# EAGLE design 89c2051-a5000-ps2 (EAGLE 4.16)
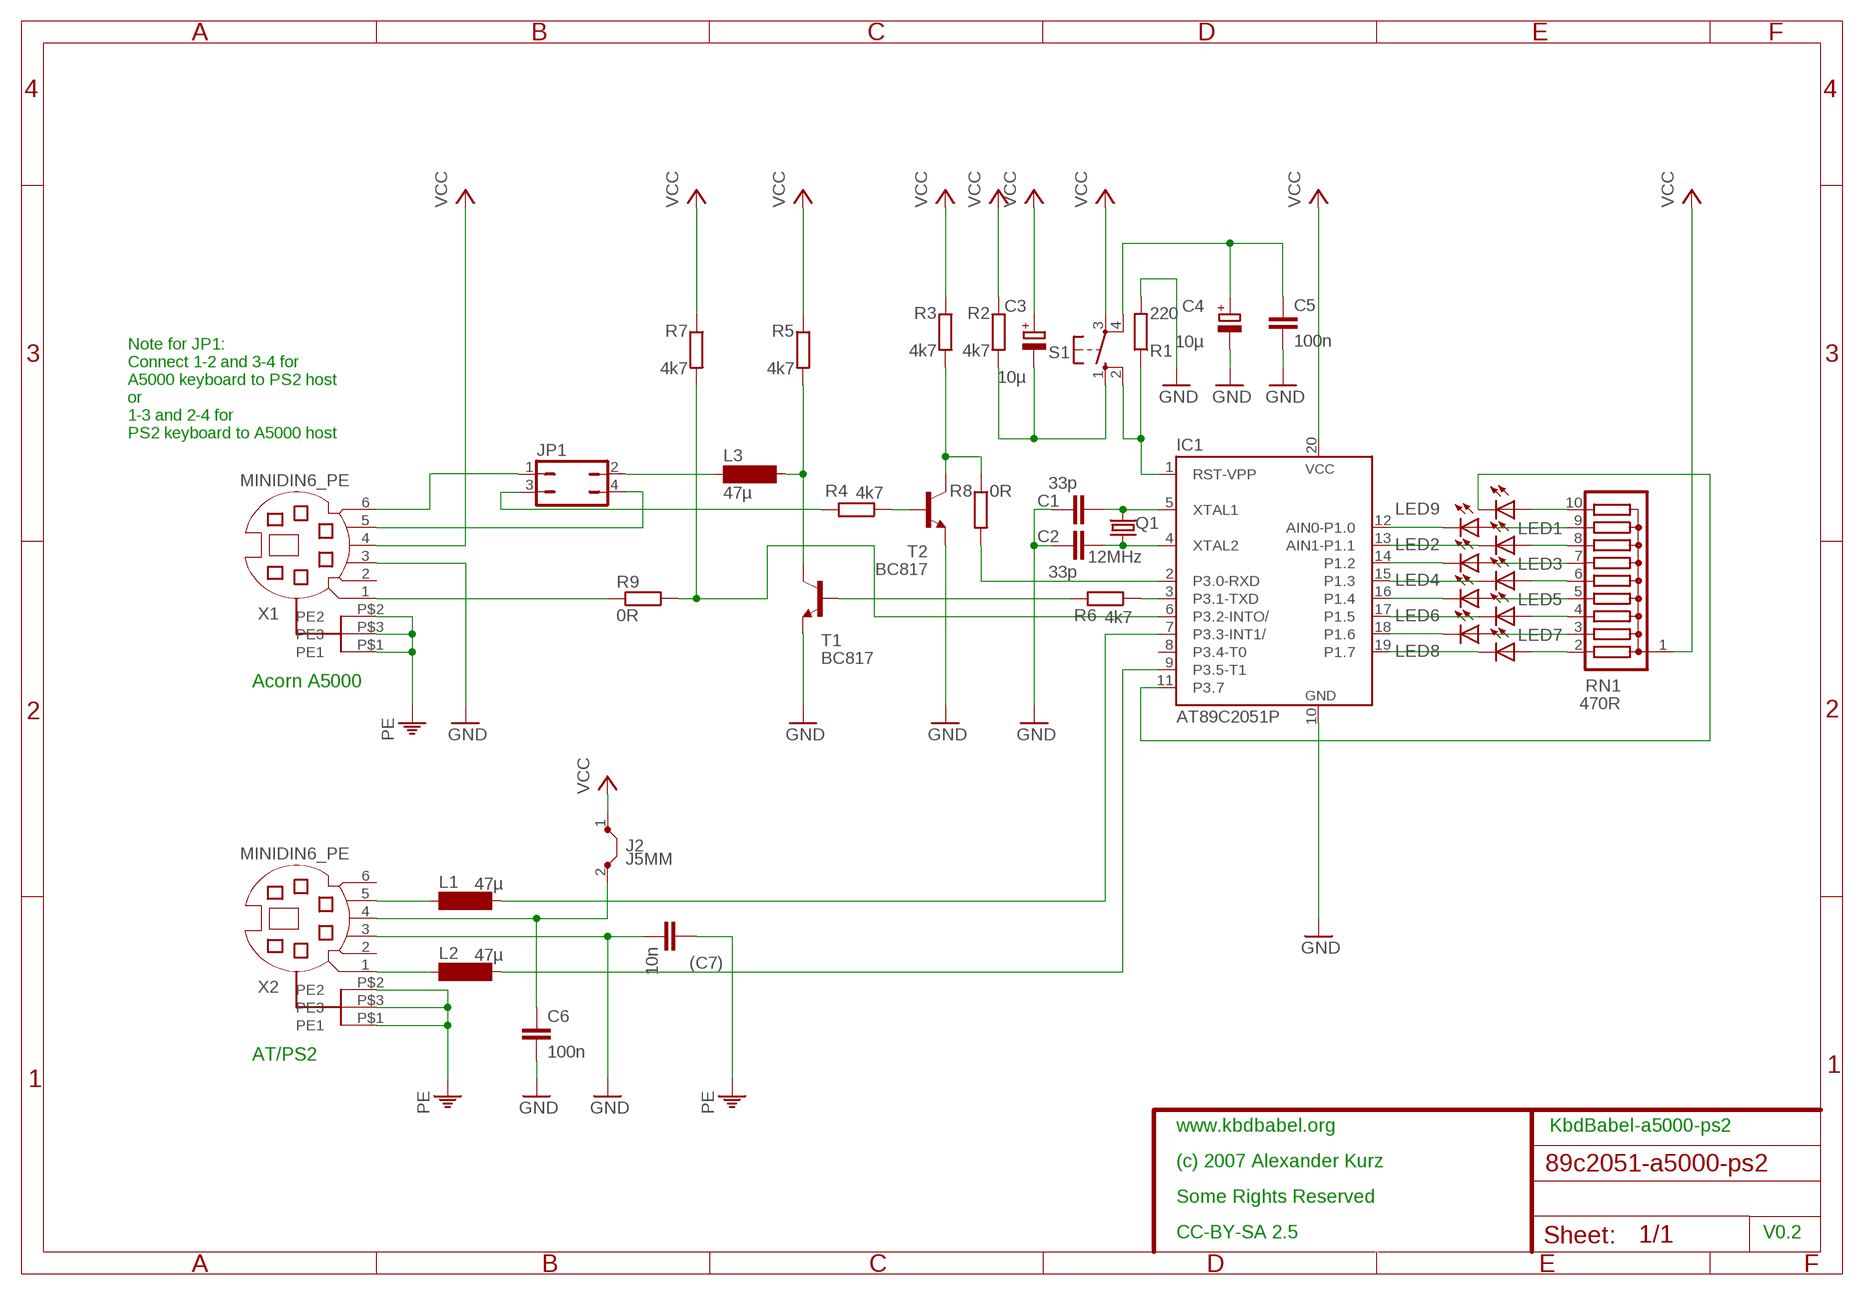
[diagram p0: schematic, sheet 1]

## Parts
(C7)  10n  C-EUC1206  [C1206]
C1  33p  C-EUC0805  [C0805]
C2  33p  C-EUC0805  [C0805]
C3  10µ  CPOL-EUE2-5  [E2-5]
C4  10µ  CPOL-EUE2-5  [E2-5]
C5  100n  C-EUC1206  [C1206]
C6  100n  C-EUC1206  [C1206]
IC1  AT89C2051P  [DIL20]
J2  J5MM  [05]
JP1  JP2Q  [JP2Q]
L1  47µ  SD75  [SD75]
L2  47µ  SD75  [SD75]
L3  47µ  SD75  [SD75]
LED1  LEDSQR2X5  [LED2X5]
LED2  LEDSQR2X5  [LED2X5]
LED3  LEDSQR2X5  [LED2X5]
LED4  LEDSQR2X5  [LED2X5]
LED5  LEDSQR2X5  [LED2X5]
LED6  LEDSQR2X5  [LED2X5]
LED7  LEDSQR2X5  [LED2X5]
LED8  LEDSQR2X5  [LED2X5]
LED9  LEDSQR2X5  [LED2X5]
Q1  12MHz  CRYSTALHC49U70  [HC49U70]
R1  220  R-EU_R1206  [R1206]
R2  4k7  R-EU_R1206  [R1206]
R3  4k7  R-EU_R1206  [R1206]
R4  4k7  R-EU_0204/5  [0204/5]
R5  4k7  R-EU_R1206  [R1206]
R6  4k7  R-EU_R0805  [R0805]
R7  4k7  R-EU_R1206  [R1206]
R8  0R  R-EU_R1206  [R1206]
R9  0R  R-EU_R1206  [R1206]
RN1  470R  G09R  [SIL10]
S1  10-XX  [B3F-10XX]
T1  BC817  BC817-NPN-SOT23-BEC  [SOT23-BEC]
T2  BC817  BC817-NPN-SOT23-BEC  [SOT23-BEC]
X1  MINIDIN6_PE  [MINIDIN6_PE]
X2  MINIDIN6_PE  [MINIDIN6_PE]

## Nets
GND: (C7).2 C1.1 C2.2 C4.- C5.2 C6.2 IC1.10(GND) R1.2 T1.E T2.E X1.3 X2.3
N$1: C1.2 IC1.5(XTAL1) Q1.2
N$2: C2.1 IC1.4(XTAL2) Q1.1
N$3: L1.1 X2.5
N$4: LED1.A RN1.9
N$5: IC1.17(P1.5) LED6.K(C)
N$6: IC1.3(P3.1-TXD) R6.1
N$7: C4.+ C5.1 S1.4(P1)
N$8: IC1.12(AIN0-P1.0) LED1.K(C)
N$9: IC1.1(RST-VPP) R1.1 S1.2(S1)
N$10: C6.1 J2.2 X2.4
N$11: IC1.7(P3.3-INT1/) L1.2
N$12: IC1.9(P3.5-T1) L2.2
N$13: IC1.13(AIN1-P1.1) LED2.K(C)
N$14: LED3.A RN1.7
N$15: IC1.15(P1.3) LED4.K(C)
N$16: LED5.A RN1.5
N$17: LED2.A RN1.8
N$18: LED4.A RN1.6
N$19: LED6.A RN1.4
N$20: IC1.18(P1.6) LED7.K(C)
N$21: LED8.A RN1.2
N$22: LED7.A RN1.3
N$23: IC1.19(P1.7) LED8.K(C)
N$24: IC1.16(P1.4) LED5.K(C)
N$25: IC1.14(P1.2) LED3.K(C)
N$26: L2.1 X2.1
N$27: LED9.A RN1.10
N$28: IC1.11(P3.7) LED9.K(C)
N$29: R9.1 X1.1
N$30: R4.1 T2.B
N$32: R3.2 R8.1 T2.C
N$33: L3.2 R5.2 T1.C
N$34: R6.2 T1.B
N$35: IC1.6(P3.2-INTO/) R7.2 R9.2
N$36: IC1.2(P3.0-RXD) R8.2
N$37: C3.- R2.2 S1.1(S)
N$38: JP1.2 L3.1
N$39: JP1.1 X1.6
N$40: JP1.4 X1.5
N$41: JP1.3 R4.2
PE: (C7).1 X1.P$1(PE1) X1.P$2(PE2) X1.P$3(PE3) X2.P$1(PE1) X2.P$2(PE2) X2.P$3(PE3)
VCC: C3.+ IC1.20(VCC) J2.1 R2.1 R3.1 R5.1 R7.1 RN1.1 S1.3(P) X1.4
Unconnected: IC1.8(P3.4-T0) X1.2 X2.2 X2.6

## Notes on the sheet
- Note for JP1:
- Connect 1-2 and 3-4 for
- A5000 keyboard to PS2 host
- or
- 1-3 and 2-4 for
- PS2 keyboard to A5000 host
- Acorn A5000
- AT/PS2
- www.kbdbabel.org | KbdBabel-a5000-ps2
- (c) 2007 Alexander Kurz
- Some Rights Reserved
- CC-BY-SA 2.5 | V0.2

## Library data of the parts
(C7) C1 C2 C5 C6 = rcl:C-EU: CAPACITOR, European symbol
C3 C4 = rcl:CPOL-EU: POLARIZED CAPACITOR, European symbol
IC1 = atmel:AT89C2051: 80C31 MICROCONTROLLER 2 Kbytes FLASH 2.7 V
J2 = jumper:J: Bridge
JP1 = jumper:JP2Q: JUMPER
L1-L3 = inductor-neosid:SD75: INDUCTOR nominal inductance, E12
LED1-LED9 = led:LED: LED OSRAM: - CHIPLED LG R971, LG N971, LY N971, LG Q971, LY Q971, LO R971, LY R971 LH N974, LH R974 LS Q976, LO Q976, LY Q976 LO Q996 - Hyper CHIPLED LW Q18S LB Q993, LB Q99A, LB R99A - SideLED LS A670, LO A670, LY A670, LG A670, LP A670 LB A673, LV A673, LT A673, LW A673 LH A674 LY A675 LS A676, LA A676, LO A676, LY A676, LW A676 LS A679, LY A679, LG A679 - Hyper Micro SIDELED® LS Y876, LA Y876, LO Y876, LY Y876 LT Y87S - SmartLED LW L88C, LW L88S LB L89C, LB L89S, LG L890 LS L89K, LO L89K, LY L89K LS L896, LA L896, LO L896, LY L896 - TOPLED LS T670, LO T670, LY T670, LG T670, LP T670 LSG T670, LSP T670, LSY T670, LOP T670, LYG T670 LG T671, LOG T671, LSG T671 LB T673, LV T673, LT T673, LW T673 LH T674 LS T676, LA T676, LO T676, LY T676, LB T676, LH T676, LSB T676, LW T676 LB T67C, LV T67C, LT T67C, LS T67K, LO T67K, LY T67K, LW E67C LS E67B, LA E67B, LO E67B, LY E67B, LB E67C, LV E67C, LT E67C LW T67C LS T679, LY T679, LG T679 LS T770, LO T770, LY T770, LG T770, LP T770 LB T773, LV T773, LT T773, LW T773 LH T774 LS E675, LA E675, LY E675, LS T675 LS T776, LA T776, LO T776, LY T776, LB T776 LHGB T686 LT T68C, LB T68C - Hyper Mini TOPLED® LB M676 - Mini TOPLED Santana® LG M470 LS M47K, LO M47K, LY M47K Source: http://www.osram.convergy.de - LUMILED® LXK2-PW12-R00, LXK2-PW12-S00, LXK2-PW14-U00, LXK2-PW14-V00 LXK2-PM12-R00, LXK2-PM12-S00, LXK2-PM14-U00 LXK2-PE12-Q00, LXK2-PE12-R00, LXK2-PE12-S00, LXK2-PE14-T00, LXK2-PE14-U00 LXK2-PB12-K00, LXK2-PB12-L00, LXK2-PB12-M00, LXK2-PB14-N00, LXK2-PB14-P00, LXK2-PB14-Q00 LXK2-PR12-L00, LXK2-PR12-M00, LXK2-PR14-Q00, LXK2-PR14-R00 LXK2-PD12-Q00, LXK2-PD12-R00, LXK2-PD12-S00 LXK2-PH12-R00, LXK2-PH12-S00 LXK2-PL12-P00, LXK2-PL12-Q00, LXK2-PL12-R00 Source: www.luxeon.com
Q1 = crystal:CRYSTAL: CRYSTAL
R1-R9 = rcl:R-EU_: RESISTOR, European symbol
RN1 = resistor-sil:G09R: SIL RESISTOR
S1 = switch-omron:10-XX: OMRON SWITCH
T1 T2 = transistor:*-NPN-: NPN Transistror
X1 X2 = bla:MINIDIN6_PE

## Board
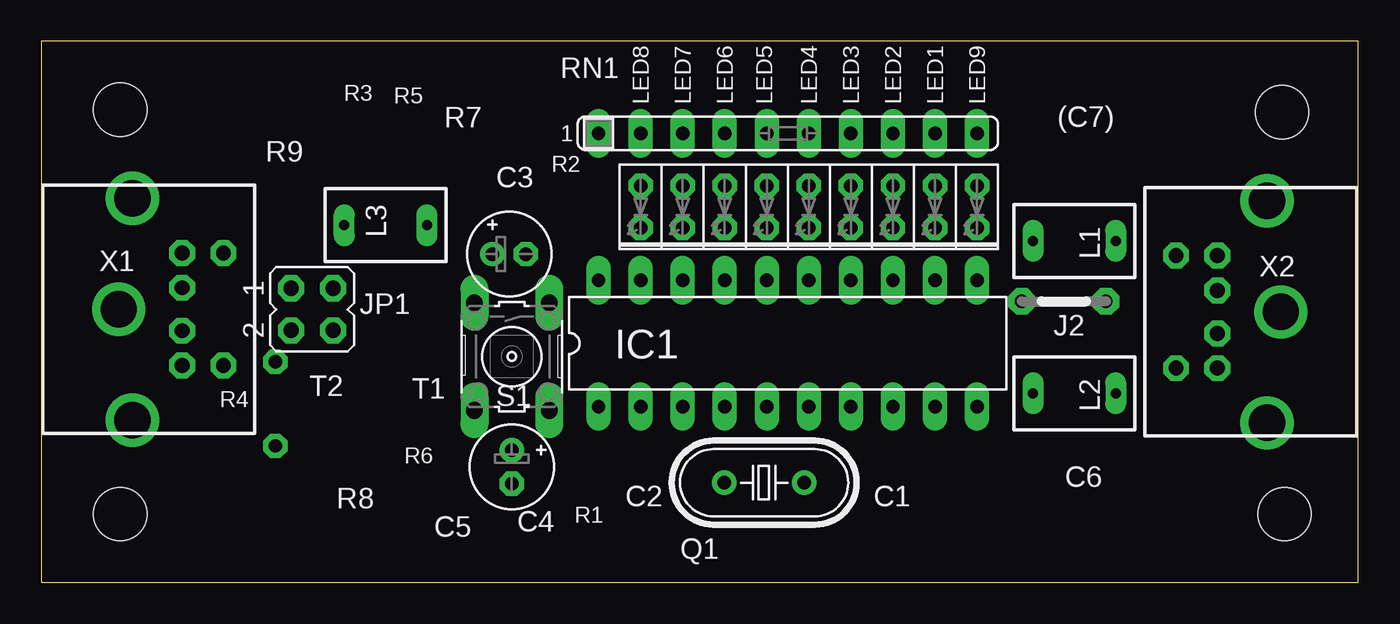
[diagram p1: board, top side]
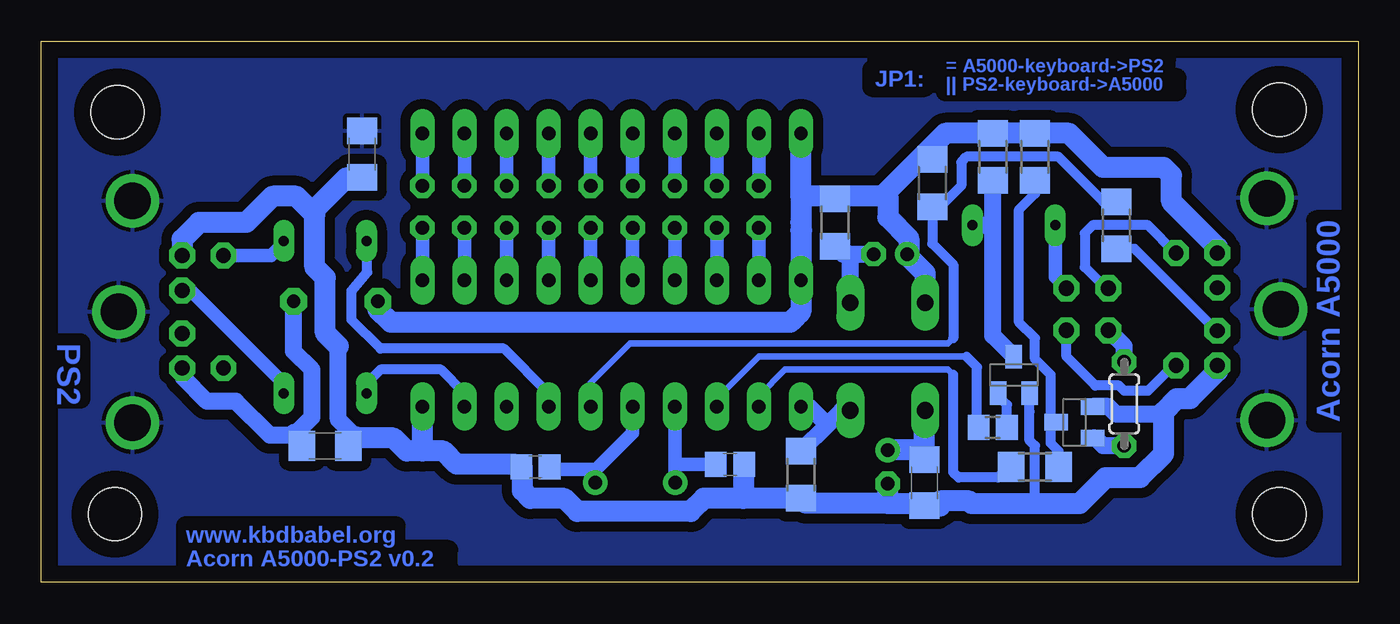
[diagram p2: board, bottom side, seen from below]

Size 79.52 x 32.69 mm. Coordinates in mm from the lower left corner, seen from the top.
Outline: 79.52,0 79.52,32.69 0,32.69 0,0 79.52,0
Copper layers (1*16): Top 0.035mm / dielectric 1.5mm / Bottom 0.035mm
Design rules "default": minimum track width 16mil, minimum drill 24mil, track to track 12mil, track to pad 12mil, pad to pad 14mil, via to via 16mil, smd to smd 16mil, copper to edge 40mil, drill to drill 8mil, minimum pad ring 13mil, minimum via ring 8mil, stop-mask expansion 4mil, vias tented up to drill 0mil, thermal gap 10mil
Holes 3.2 mm at 75.08,4.12 74.92,28.41 4.76,28.57 4.76,4.12

### Footprints (pad centres in the part's own frame; a part is rotated, then mirrored left to right if it is on the bottom)
C1206 = smd 1.6 x 1.8: 1 -1.4,0; 2 1.4,0
C0805 = smd 1.3 x 1.5: 1 -0.85,0; 2 0.85,0
E2-5 = drill 0.813 pad 1.27 round: + -1.016,0 | drill 0.813 pad 1.27 octagon: - 1.016,0
DIL20 = drill 0.813 long: 1 -11.43,-3.81; 2 -8.89,-3.81; 3 -6.35,-3.81; 4 -3.81,-3.81; 5 -1.27,-3.81; 6 1.27,-3.81; 7 3.81,-3.81; 8 6.35,-3.81; 9 8.89,-3.81; 10 11.43,-3.81; 11 11.43,3.81; 12 8.89,3.81; 13 6.35,3.81; 14 3.81,3.81; 15 1.27,3.81; 16 -1.27,3.81; 17 -3.81,3.81; 18 -6.35,3.81; 19 -8.89,3.81; 20 -11.43,3.81
05 = drill 0.813 pad 1.6 octagon: 1 -2.54,0; 2 2.54,0
JP2Q = drill 0.914 octagon: 1 -1.27,-1.27; 2 -1.27,1.27; 3 1.27,-1.27; 4 1.27,1.27
SD75 = drill 0.6 long: 1 -2.5,0; 2 2.5,0
LED2X5 = drill 0.813 octagon: A -1.27,0; K 1.27,0
HC49U70 = drill 0.813 round: 1 -2.413,0; 2 2.413,0
R1206 = smd 1.6 x 1.803: 1 -1.422,0; 2 1.422,0
0204/5 = drill 0.813 octagon: 1 -2.54,0; 2 2.54,0
R0805 = smd 1.3 x 1.5: 1 -0.85,0; 2 0.85,0
SIL10 = drill 0.813 long: 1 -11.43,0; 2 -8.89,0; 3 -6.35,0; 4 -3.81,0; 5 -1.27,0; 6 1.27,0; 7 3.81,0; 8 6.35,0; 9 8.89,0; 10 11.43,0
B3F-10XX = drill 1.016 long: 1 -3.251,2.261; 2 3.251,2.261; 3 -3.251,-2.261; 4 3.251,-2.261
SOT23-BEC = smd 1 x 1.4: B -0.95,-1.1; C 0,1.1; E 0.95,-1.1
MINIDIN6_PE = drill 0.9 octagon: 1 1.3,2.15; 2 -1.3,2.15; 3 3.4,2.15; 4 -3.4,2.15; 5 3.4,4.65; 6 -3.4,4.65 | drill 2.2 round: P$1 0,-1.676; P$2 -6.706,-0.838; P$3 6.706,-0.838

### Placement (x,y rotation side)
(C7)  60.16,25.87 270 bottom
C1  49.68,6.98 0 bottom
C2  37.94,7.14 0 bottom
C3  28.25,19.84 0 top
C4  28.41,6.98 270 top
C5  26.19,6.03 270 bottom
C6  62.38,8.25 0 bottom
IC1  45.08,14.44 0 top
J2  61.75,16.98 0 top
JP1  16.35,16.5 270 top
L1  62.38,20.63 180 top
L2  62.38,11.42 180 top
L3  20.79,21.58 0 top
LED1  53.97,22.69 270 top
LED2  51.43,22.69 270 top
LED3  48.89,22.69 270 top
LED4  46.35,22.69 270 top
LED5  43.81,22.69 270 top
LED6  41.27,22.69 270 top
LED7  38.73,22.69 270 top
LED8  36.19,22.69 270 top
LED9  56.51,22.69 270 top
Q1  43.65,6.03 0 top
R1  33.65,6.5 270 bottom
R2  31.59,21.74 270 bottom
R3  19.52,25.71 270 bottom
R4  14.12,10.79 90 bottom
R5  22.06,25.71 270 bottom
R6  22.06,9.36 0 bottom
R7  25.71,24.12 270 bottom
R8  19.52,6.98 180 bottom
R9  14.6,21.58 90 bottom
RN1  45.08,27.14 0 top
S1  28.41,13.65 270 top
T1  20.79,12.54 0 bottom
T2  17.14,9.68 90 bottom
X1  6.35,16.5 270 top
X2  73.18,16.34 90 top

### Tracks (layer width: path | path; a pad name or v marks a point on that pad's centre or on a via)
GND
  Bottom 0.61: 19.52,4.6 19.52,4.76 19.52,8.25 19.84,8.57 19.84,10.31 19.84,10.32 T1.E
  Bottom 1.016: 61.59,14.28 61.59,9.84 60.56,8.8 60.48,8.72 | T2.E 15.07,10.63 14.6,10.15 11.74,10.15
  Bottom 1.27: 28.41,4.78 33.36,4.78 R1.2 37.14,5.08 | 28.41,4.78 28.41,4.76 26.19,4.76 C5.2 | 28.41,4.78 C4.- | 37.14,5.08 39.52,5.08 40.32,4.28 47.14,4.28 47.94,5.07 50,5.07 50.48,5.55 50.48,6.98 C1.1 50.53,6.92 50.64,6.82 50.95,7.14 54.45,7.14 55.24,7.93 56.51,7.93 | 37.14,5.08 37.14,5.07 37.09,5.13 C2.2 | 60.32,24.44 60.29,24.47 (C7).2 | 60.32,24.44 60.48,24.6 | X2.3 71.03,20.72 70,21.74 67.15,21.74 65.56,23.33 64.13,23.33 63.18,22.38 | 63.18,22.38 63.02,22.22 63.02,19.04 62.38,18.41 62.38,15.07 61.59,14.28 | 60.48,8.72 58.26,8.72 57.46,7.93 56.51,7.93 | 56.51,7.93 IC1.10 | 60.56,8.8 | C6.2 60.98,8.38 60.56,8.8 | 63.18,22.38 61.11,24.44 60.32,24.44 | C5.2 | C5.2 26.35,4.63 26.35,4.6 25.24,4.6 25.24,4.91 23.49,4.91 23.33,4.76 19.52,4.76 16.82,4.76 15.23,6.34 13.17,6.34 11.74,7.77 11.74,10.15 11.74,10.31 10.95,11.11 10.15,11.11 8.49,12.77 X1.3
N$1
  Bottom 0.813: IC1.5 43.81,9.04 46.03,6.82 | C1.2 48.57,6.98 48.41,6.82 46.03,6.82 | Q1.2 46.06,6.79 46.03,6.82
N$2
  Bottom 0.813: 41.27,6.03 | 41.27,6.03 Q1.1 | 41.27,7.14 41.27,6.03 | 41.27,7.14 IC1.4 | C2.1 41.27,7.14 | 41.27,7.14
N$3
  Bottom 0.813: L1.1 64.88,20.51 65.65,19.74 X2.5
N$4
  Bottom 0.813: LED1.A RN1.9
N$5
  Bottom 0.813: IC1.17 LED6.K
N$6
  Bottom 0.406: IC1.3 38.73,11.11 36.67,13.17 | 36.67,13.17 | 36.51,13.33 36.67,13.17 | 36.51,13.33 | 36.51,13.33 36.19,13.65 23.65,13.65
  Bottom 0.61: 23.65,13.65 23.01,13.01 23.01,9.52 22.91,9.42 R6.1
N$7
  Bottom 1.27: C5.1 | S1.4 26.19,10.39 26.19,8.09 | C5.1 26.19,8.09 | C4.+ 26.19,7.99 26.19,8.09
N$8
  Bottom 0.813: IC1.12 LED1.K
N$9
  Bottom 1.016: R1.1 32.06,9.52 | S1.2 31.19,10.39 32.06,9.52 | 32.06,9.52 | IC1.1 33.17,10.63 32.06,9.52
N$10
  Bottom 1.016: J2.2 64.29,13.96 63.18,12.85 63.18,9.99 64.21,8.96 64.29,8.88 65.72,8.88 67.78,10.95 69.53,10.95 70.96,12.38 70.96,13.01 X2.4
  Bottom 1.27: C6.1 63.78,8.54 64.21,8.96
N$11
  Bottom 0.61: IC1.7 48.89,11.42 51.59,14.12 59.05,14.12 60.8,15.87 60.8,17.61 59.84,18.73 59.84,20.47 59.88,20.51 L1.2
N$12
  Bottom 0.61: IC1.9 53.97,11.42 55.4,12.85 59.05,12.85 59.84,12.06 L2.2
N$13
  Bottom 0.813: IC1.13 LED2.K
N$14
  Bottom 0.813: LED3.A RN1.7
N$15
  Bottom 0.813: IC1.15 LED4.K
N$16
  Bottom 0.813: LED5.A RN1.5
N$17
  Bottom 0.813: RN1.8 | LED2.A RN1.8
N$18
  Bottom 0.813: RN1.6 | LED4.A RN1.6
N$19
  Bottom 0.813: LED6.A RN1.4
N$20
  Bottom 0.813: IC1.18 LED7.K
N$21
  Bottom 0.813: RN1.2 | LED8.A RN1.2
N$22
  Bottom 0.813: LED7.A RN1.3
N$23
  Bottom 0.813: IC1.19 LED8.K
N$24
  Bottom 0.813: IC1.16 LED5.K
N$25
  Bottom 0.813: IC1.14 LED3.K
N$26
  Bottom 0.813: L2.1 64.88,12.02 70.48,17.61 70.96,17.61 70.99,17.64 X2.1
N$27
  Bottom 0.813: RN1.10 | LED9.A RN1.10
N$28
  Bottom 0.813: IC1.11 LED9.K
N$29
  Bottom 0.61: R9.1 13.49,20.15 8.54,15.2 X1.1
N$30
  Bottom 1.016: T2.B 15.87,8.73 15.39,8.25 R4.1
N$32
  Bottom 0.61: R8.1 18.1,7.94 18.57,8.41 18.57,9.68 | 19.52,23.96 | R3.2 19.52,23.96 | 18.57,9.68 18.41,9.68 | 18.41,9.68 T2.C | 18.41,9.68 | 18.57,9.68 18.57,12.53 19.52,13.49 19.52,14.76 20.47,15.71 20.47,22.54 19.52,23.49 19.52,24.12 | R3.2 | R3.2 | 19.52,24.12 | 19.52,24.12 R3.2
N$33
  Bottom 0.61: 22.06,24.12 | 22.06,24.12 R5.2 | 20.95,13.65 20.94,13.63 T1.C 20.79,13.65
  Bottom 1.016: T1.C 20.79,13.65 22.06,14.92 22.06,21.58 | 22.06,21.58 22.06,24.12 | 22.06,21.58 L3.2 22.38,21.58
N$34
  Bottom 0.61: 21.11,9.36 R6.2 21.21,10.73 21.74,11.26 21.74,11.27 T1.B
N$35
  Bottom 0.406: IC1.6 46.35,12.06 43.97,14.44 24.76,14.44 24.44,14.76
  Bottom 0.61: R7.2 | R9.2 15.39,23.01 18.09,25.71 23.65,25.71 23.97,25.39 23.97,23.96 25.24,22.69 25.24,22.7 R7.2 | R7.2 25.71,20.47 24.44,19.2 24.44,14.76
N$36
  Bottom 0.406: IC1.2 36.19,11.26 34.6,12.85 24.76,12.85 24.44,12.53
  Bottom 0.61: 24.44,12.53 24.44,6.66 24.12,6.34 21.74,6.34 21.11,6.98 | 21.11,6.98 | R8.2 21.11,6.98
N$37
  Bottom 1.016: R2.2 31.11,19.84 30.63,19.84 | 30.63,19.84 C3.- | 30.63,19.84 30.67,19.8 S1.1
N$38
  Bottom 0.813: JP1.2 | L3.1 18.29,18.45 JP1.2
N$39
  Bottom 0.61: JP1.1 | JP1.1 15.23,17.77 16.5,19.04 16.5,21.11 16.03,21.58 12.69,21.58 10.99,19.88 | 10.99,19.88 10.95,19.84 | X1.6 10.99,19.88
N$40
  Bottom 0.61: JP1.4 17.62,13.65 15.87,11.9 14.44,11.9 14.12,11.58 12.69,11.58 11.11,13.17 11.04,13.1 X1.5
N$41
  Bottom 1.016: JP1.3 | R4.2 14.12,14.28 JP1.3
PE
  pour Bottom (isolate 0.61): -0.16,-0.17 79.69,-0.17 79.69,32.85 -0.16,32.85
VCC
  Bottom 0.813: 33.65,21.74 33.49,21.74
  Bottom 1.016: 33.65,21.27 33.49,21.27
  Bottom 1.27: 33.65,17.46 33.65,16.34 33.97,16.03 | 33.65,17.46 IC1.20 33.65,21.27 33.65,21.74 33.65,23.33 | 33.97,16.03 34.28,15.71 57.78,15.71 | 57.78,15.71 | 33.97,16.03 | 33.97,16.03 | 33.65,17.46 | 33.65,23.33 RN1.1 | J2.1 59.21,16.5 58.41,15.71 57.78,15.71 | 28.73,23.33 28.41,23.33 28.41,22.06 27.14,20.79 27.14,20 27.24,19.9 C3.+ 27.3,19.84 | 28.73,23.33 31.59,23.33 | 31.59,23.33 33.65,23.33 | 19.52,26.98 | R3.1 19.52,26.98 | 19.52,26.98 19.36,27.14 | R3.1 21.75,27.13 21.9,26.98 R5.1 24.93,27.13 25.39,26.66 | 25.39,26.66 25.71,26.35 | 25.71,26.35 28.73,23.33 | 25.39,26.66 | R3.1 19.21,27.13 19.2,27.14 17.46,27.14 15.39,25.08 11.74,25.08 11.27,24.6 11.27,23.01 8.49,20.24 X1.4 | 31.59,23.33 R2.1 | R2.1 | R2.1 | 27.3,19.84 | S1.3 26.15,18.69 27.3,19.84 | 25.71,26.35 | 25.71,26.35 R7.1

### Text on the board
Bottom: = A5000-keyboard->PS2 | JP1: | || PS2-keyboard->A5000 | PS2 | Acorn A5000 | www.kbdbabel.org | Acorn A5000-PS2 v0.2